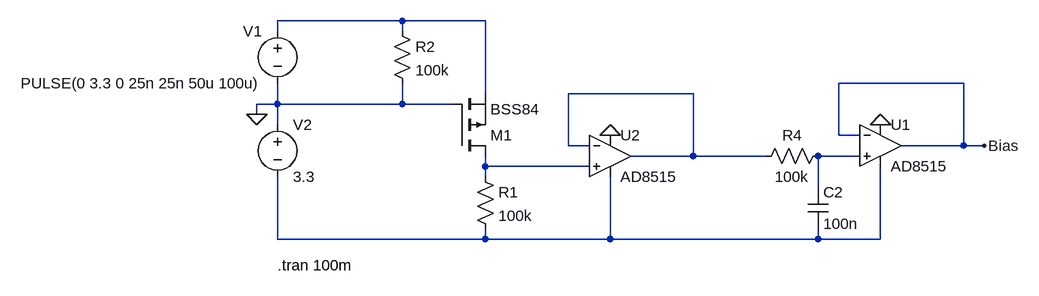
[diagram p0: schematic PABiasControl.asc]
PABiasControl.asc, the LTspice schematic file:
Version 4
SHEET 1 1684 680
WIRE 304 64 112 64
WIRE 432 64 304 64
WIRE 112 80 112 64
WIRE 304 80 304 64
WIRE 1168 160 976 160
WIRE 432 176 432 64
WIRE 752 176 560 176
WIRE 112 192 112 160
WIRE 112 192 80 192
WIRE 304 192 304 160
WIRE 304 192 112 192
WIRE 384 192 304 192
WIRE 80 208 80 192
WIRE 112 224 112 192
WIRE 976 240 976 160
WIRE 1008 240 976 240
WIRE 560 256 560 176
WIRE 592 256 560 256
WIRE 1168 256 1168 160
WIRE 1168 256 1072 256
WIRE 1200 256 1168 256
WIRE 752 272 752 176
WIRE 752 272 656 272
WIRE 864 272 752 272
WIRE 1008 272 944 272
WIRE 432 288 432 272
WIRE 592 288 432 288
WIRE 432 304 432 288
WIRE 944 320 944 272
WIRE 112 400 112 304
WIRE 432 400 432 384
WIRE 432 400 112 400
WIRE 624 400 624 304
WIRE 624 400 432 400
WIRE 944 400 944 384
WIRE 944 400 624 400
WIRE 1040 400 1040 288
WIRE 1040 400 944 400
FLAG 80 208 0
FLAG 1040 224 0
FLAG 624 240 0
FLAG 1200 256 Bias
SYMBOL voltage 112 64 M0
WINDOW 123 0 0 Left 0
WINDOW 39 0 0 Left 0
SYMATTR InstName V1
SYMATTR Value PULSE(0 3.3 0 25n 25n 50u 100u)
SYMBOL voltage 112 208 R0
WINDOW 123 0 0 Left 0
WINDOW 39 0 0 Left 0
SYMATTR InstName V2
SYMATTR Value 3.3
SYMBOL pmos 384 272 M180
SYMATTR InstName M1
SYMATTR Value BSS84
SYMBOL res 416 288 R0
SYMATTR InstName R1
SYMATTR Value 100k
SYMBOL res 288 64 R0
SYMATTR InstName R2
SYMATTR Value 100k
SYMBOL Opamps\\AD8515 1040 192 R0
SYMATTR InstName U1
SYMBOL cap 928 320 R0
SYMATTR InstName C2
SYMATTR Value 100n
SYMBOL res 960 256 R90
WINDOW 0 0 56 VBottom 2
WINDOW 3 32 56 VTop 2
SYMATTR InstName R4
SYMATTR Value 100k
SYMBOL Opamps\\AD8515 624 208 R0
SYMATTR InstName U2
TEXT 112 440 Left 2 !.tran 100m

The netlist it stands for:
* PABiasControl.asc
V1 N001 0 PULSE(0 3.3 0 25n 25n 50u 100u)
V2 0 N005 3.3
M1 N004 0 N001 N001 BSS84
R1 N004 N005 100k
R2 N001 0 100k
XU1 N003 Bias 0 N005 Bias AD8515  ; pins In+ In- V+ V- OUT
C2 N003 N005 100n
R4 N003 N002 100k
XU2 N004 N002 0 N005 N002 AD8515  ; pins In+ In- V+ V- OUT
.model NMOS NMOS
.model PMOS PMOS
.lib standard.mos
.tran 100m
.lib ADI.lib
.backanno
.end